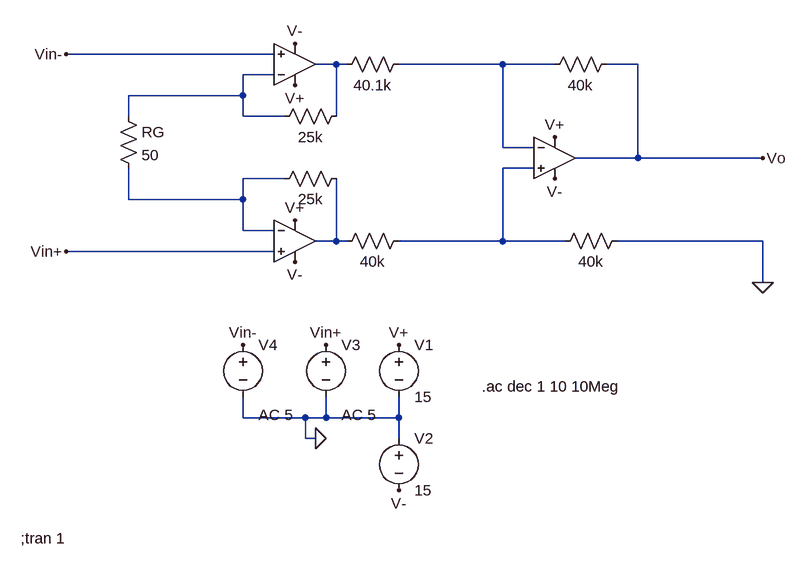
[diagram p0: schematic B_part_2.asc]
B_part_2.asc, the LTspice schematic file:
Version 4
SHEET 1 976 732
WIRE 176 -32 -144 -32
WIRE 272 -16 240 -16
WIRE 288 -16 272 -16
WIRE 528 -16 368 -16
WIRE 608 -16 528 -16
WIRE 736 -16 688 -16
WIRE 176 0 128 0
WIRE 128 32 128 0
WIRE 128 32 -48 32
WIRE -48 64 -48 32
WIRE 128 64 128 32
WIRE 192 64 128 64
WIRE 272 64 272 -16
WIRE 528 112 528 -16
WIRE 576 112 528 112
WIRE 736 128 736 -16
WIRE 736 128 640 128
WIRE 928 128 736 128
WIRE 576 144 528 144
WIRE 192 160 128 160
WIRE -48 192 -48 144
WIRE 128 192 128 160
WIRE 128 192 -48 192
WIRE 128 240 128 192
WIRE 176 240 128 240
WIRE 272 256 272 160
WIRE 272 256 240 256
WIRE 288 256 272 256
WIRE 528 256 528 144
WIRE 528 256 368 256
WIRE 624 256 528 256
WIRE 928 256 704 256
WIRE 176 272 -144 272
WIRE 928 320 928 256
WIRE 128 528 128 496
WIRE 224 528 128 528
WIRE 256 528 256 496
WIRE 256 528 224 528
WIRE 368 528 368 496
WIRE 368 528 256 528
WIRE 224 560 224 528
WIRE 240 560 224 560
WIRE 368 560 368 528
FLAG 208 224 V+
FLAG 208 16 V+
FLAG 608 96 V+
FLAG 368 416 V+
FLAG 608 160 V-
FLAG 208 288 V-
FLAG 208 -48 V-
FLAG 368 640 V-
FLAG 928 320 0
FLAG 240 560 0
FLAG -144 272 Vin+
FLAG -144 -32 Vin-
FLAG 928 128 Vo
FLAG 256 416 Vin+
FLAG 128 416 Vin-
SYMBOL OpAmps\\UniversalOpamp2 208 -16 M180
WINDOW 0 16 -32 Invisible 2
SYMATTR InstName U1
SYMBOL OpAmps\\UniversalOpamp2 208 256 R0
WINDOW 0 16 -32 Invisible 2
SYMATTR InstName U2
SYMBOL OpAmps\\UniversalOpamp2 608 128 R0
WINDOW 0 16 -32 Invisible 2
SYMATTR InstName U3
SYMBOL res 384 -32 R90
WINDOW 0 0 56 Invisible 2
WINDOW 3 32 56 VTop 2
SYMATTR InstName R1
SYMATTR Value 40.1k
SYMBOL res 704 -32 R90
WINDOW 0 0 56 Invisible 2
WINDOW 3 32 56 VTop 2
SYMATTR InstName R77
SYMATTR Value 40k
SYMBOL res 384 240 R90
WINDOW 0 0 56 Invisible 2
WINDOW 3 32 56 VTop 2
SYMATTR InstName R3
SYMATTR Value 40k
SYMBOL res 288 144 R90
WINDOW 0 0 56 Invisible 2
WINDOW 3 32 56 VTop 2
SYMATTR InstName R4
SYMATTR Value 25k
SYMBOL res 288 48 R90
WINDOW 0 0 56 Invisible 2
WINDOW 3 32 56 VTop 2
SYMATTR InstName R5
SYMATTR Value 25k
SYMBOL res 720 240 R90
WINDOW 0 0 56 Invisible 2
WINDOW 3 32 56 VTop 2
SYMATTR InstName R6
SYMATTR Value 40k
SYMBOL res -64 48 R0
SYMATTR InstName RG
SYMATTR Value 50
SYMBOL voltage 368 400 R0
WINDOW 123 0 0 Left 0
WINDOW 39 0 0 Left 0
SYMATTR InstName V1
SYMATTR Value 15
SYMBOL voltage 368 544 R0
WINDOW 123 0 0 Left 0
WINDOW 39 0 0 Left 0
SYMATTR InstName V2
SYMATTR Value 15
SYMBOL voltage 256 400 R0
WINDOW 123 24 124 Left 2
WINDOW 39 0 0 Left 0
SYMATTR InstName V3
SYMATTR Value ""
SYMATTR Value2 AC 5
SYMBOL voltage 128 400 R0
WINDOW 123 24 124 Left 2
WINDOW 39 0 0 Left 0
SYMATTR InstName V4
SYMATTR Value ""
SYMATTR Value2 AC 5
TEXT -214 714 Left 2 !;tran 1
TEXT 496 480 Left 2 !.ac dec 1 10 10Meg

The netlist it stands for:
* B_part_2.asc
XU1 Vin- N003 V+ V- N001 level.2 Avol=1Meg GBW=10Meg Slew=10Meg ilimit=25m rail=0 Vos=0 phimargin=45 en=0 enk=0 in=0 ink=0 Rin=500Meg  ; pins IN+ IN- V+ V- OUT
XU2 Vin+ N005 V+ V- N006 level.2 Avol=1Meg GBW=10Meg Slew=10Meg ilimit=25m rail=0 Vos=0 phimargin=45 en=0 enk=0 in=0 ink=0 Rin=500Meg  ; pins IN+ IN- V+ V- OUT
XU3 N004 N002 V+ V- Vo level.2 Avol=1Meg GBW=10Meg Slew=10Meg ilimit=25m rail=0 Vos=0 phimargin=45 en=0 enk=0 in=0 ink=0 Rin=500Meg  ; pins IN+ IN- V+ V- OUT
R1 N002 N001 40.1k
R77 Vo N002 40k
R3 N004 N006 40k
R4 N006 N005 25k
R5 N001 N003 25k
R6 0 N004 40k
RG N003 N005 50
V1 V+ 0 15
V2 0 V- 15
V3 Vin+ 0 AC 5
V4 Vin- 0 AC 5
;tran 1
.ac dec 1 10 10Meg
.lib UniversalOpamps2.sub
.backanno
.end